# EAGLE design LAMPS (EAGLE 6.3)
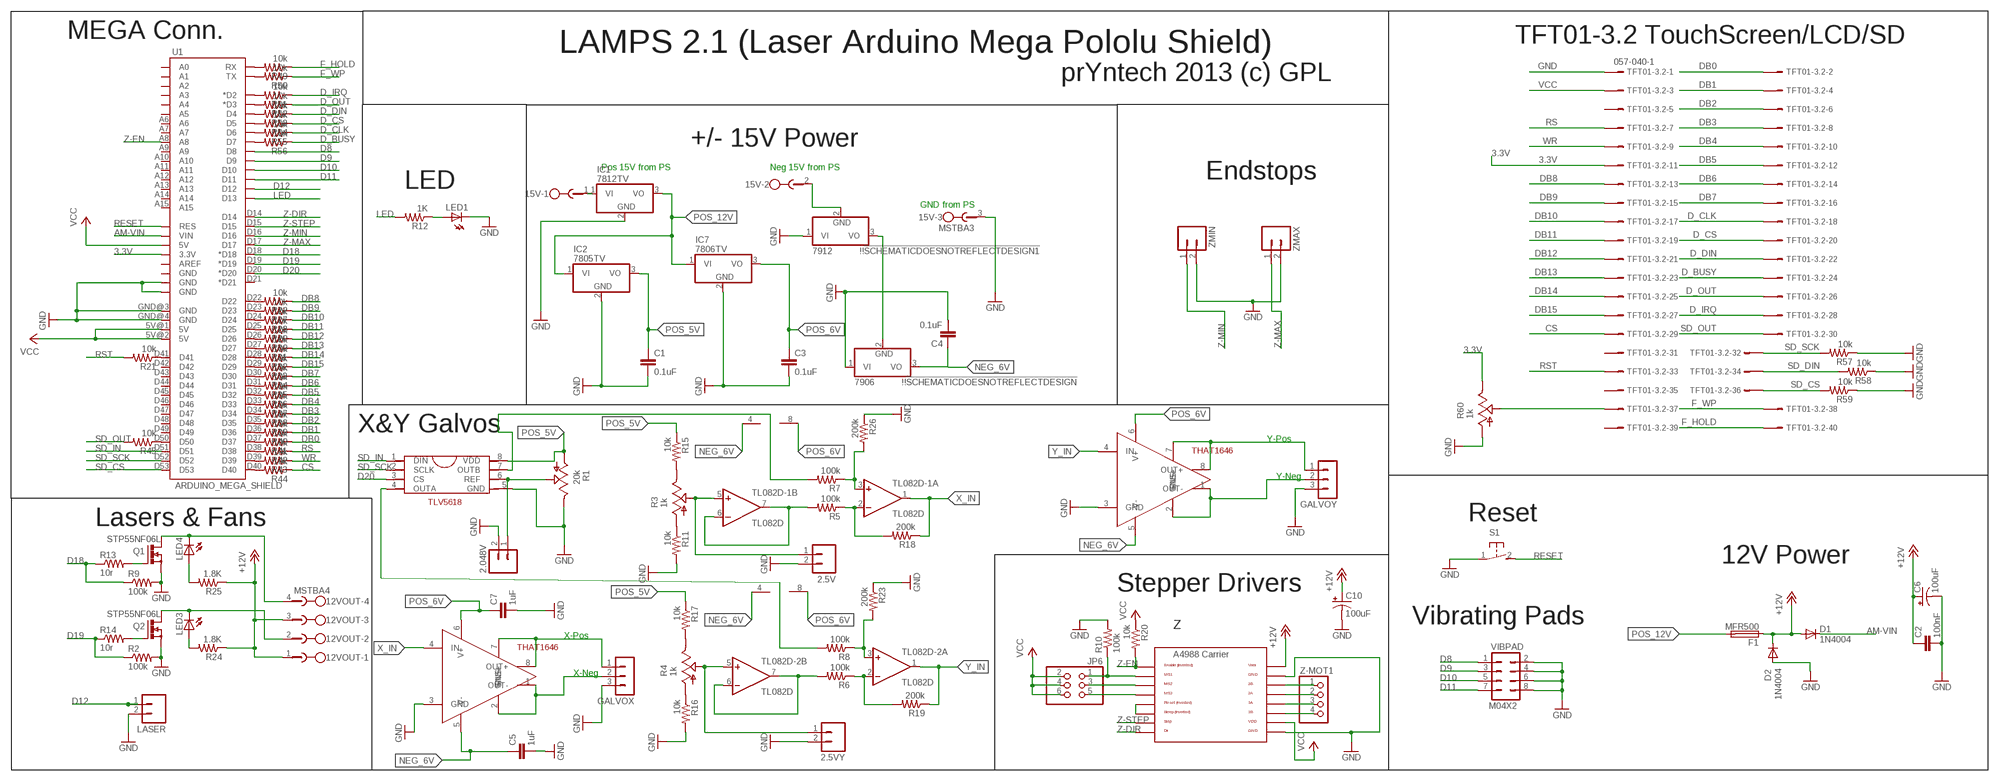
[diagram p0: schematic, sheet 1]

## Parts
2.5V  M02PTH  [1X02]
2.5VY  M02PTH  [1X02]
2.048V  M02PTH  [1X02]
12VOUT  MSTBA4  [MSTBA4]
15V  MSTBA3  [MSTBA3]
!!!SCHEMATICDOESNOTREFLECTDESIGN  7906  7805TV  [TO220V]
!!!SCHEMATICDOESNOTREFLECTDESIGN1  7912  7805TV  [TO220V]
C1  0.1uF  C2.5/2  [C2.5-2]
C2  100nF  C-EUC0805  [C0805]
C3  0.1uF  C2.5/2  [C2.5-2]
C4  0.1uF  C2.5/2  [C2.5-2]
C5  1uF  C2.5/2  [C2.5-2]
C6  100uF  CPOL-US153CLV-0605  [153CLV-0605]
C7  1uF  C2.5/2  [C2.5-2]
C10  100uF  CPOL-US153CLV-0605  [153CLV-0605]
D1  1N4004  [DO41-10]
D2  1N4004  [DO41-10]
F1  MFR500  PTCFUSE  [MFR500]
GALVOX  3PIN-HEADER  [3PIN-HEADER]
GALVOY  3PIN-HEADER  [3PIN-HEADER]
IC1  7812TV  [TO220V]
IC2  7805TV  [TO220V]
IC7  7806TV  7805TV  [TO220V]
JP6  PINHD-2X3  [2X03]
LASER  M02PTH  [1X02]
LED1  LEDCHIP-LED0805  [CHIP-LED0805]
LED3  LEDCHIP-LED0805  [CHIP-LED0805]
LED4  LEDCHIP-LED0805  [CHIP-LED0805]
Q1  STP55NF06L  IRF512  [TO220BV]
Q2  STP55NF06L  IRF512  [TO220BV]
R1  20k  TRIM_US-B25P  [B25P]
R2  100k  R-US_R0805  [R0805]
R3  1k  TRIM_US-B25P  [B25P]
R4  1k  TRIM_US-B25P  [B25P]
R5  100k  R-US_R0805  [R0805]
R6  100k  R-US_R0805  [R0805]
R7  100k  R-US_R0805  [R0805]
R8  100k  R-US_R0805  [R0805]
R9  100k  R-US_R0805  [R0805]
R10  100k  R-US_R0805  [R0805]
R11  10k  R-US_R0805  [R0805]
R12  1K  R-US_R0805  [R0805]
R13  10r  R-US_R0805  [R0805]
R14  10r  R-US_M0805  [M0805]
R15  10k  R-US_R0805  [R0805]
R16  10k  R-US_R0805  [R0805]
R17  10k  R-US_R0805  [R0805]
R18  200k  R-US_R0805  [R0805]
R19  200k  R-US_R0805  [R0805]
R20  10k  R-US_R0805  [R0805]
R21  10k  R-US_R0805  [R0805]
R22  10k  R-US_R0805  [R0805]
R23  200k  R-US_R0805  [R0805]
R24  1.8K  R-US_R0805  [R0805]
R25  1.8K  R-US_R0805  [R0805]
R26  200k  R-US_R0805  [R0805]
R27  10k  R-US_R0805  [R0805]
R28  10k  R-US_R0805  [R0805]
R29  10k  R-US_R0805  [R0805]
R30  10k  R-US_R0805  [R0805]
R31  10k  R-US_R0805  [R0805]
R32  10k  R-US_R0805  [R0805]
R33  10k  R-US_R0805  [R0805]
R34  10k  R-US_R0805  [R0805]
R35  10k  R-US_R0805  [R0805]
R36  10k  R-US_R0805  [R0805]
R37  10k  R-US_R0805  [R0805]
R38  10k  R-US_R0805  [R0805]
R39  10k  R-US_R0805  [R0805]
R40  10k  R-US_R0805  [R0805]
R41  10k  R-US_R0805  [R0805]
R42  10k  R-US_R0805  [R0805]
R43  10k  R-US_R0805  [R0805]
R44  10k  R-US_R0805  [R0805]
R45  10k  R-US_R0805  [R0805]
R49  10k  R-US_R0805  [R0805]
R50  10k  R-US_R0805  [R0805]
R51  10k  R-US_R0805  [R0805]
R52  10k  R-US_R0805  [R0805]
R53  10k  R-US_R0805  [R0805]
R54  10k  R-US_R0805  [R0805]
R55  10k  R-US_R0805  [R0805]
R56  10k  R-US_R0805  [R0805]
R57  10k  R-US_R0805  [R0805]
R58  10k  R-US_R0805  [R0805]
R59  10k  R-US_R0805  [R0805]
R60  1k  TRIM_US-B25P  [B25P]
S1  31-XX  [B3F-31XX]
TFT01-3.2  057-040-1  [057-040-1]
TL082D-1  TL082D  [SO08]
TL082D-2  TL082D  [SO08]
U1  ARDUINO_MEGA_SHIELD  [ARDUINO_MEGA_SHIELD]
U$1  THAT1646  [THAT1646]
U$2  THAT1646SMD  [TLV5618]
U$4  THAT1646  [THAT1646]
U$8  A4988BREAKOUT  [A4988BREAKOUT]
VIBPAD  M04X2  [2X4]
Z-MOT1  PINHD-1X4  [1X04]
ZMAX  M02PTH  [1X02]
ZMIN  M02PTH  [1X02]

## Nets
3.3V: R60.E TFT01-3.2.11 U1.3.3V
+12V [power]: 12VOUT.1 12VOUT.3 C2.1 C6.+ C10.+ D1.A D2.C F1.1 R24.1 R25.1 U$8.VMOT
AM-VIN [power]: D1.C U1.VIN
CS: R44.1 TFT01-3.2.29
D8: U1.D8 VIBPAD.1
D9: U1.D9 VIBPAD.3
D10: U1.D10 VIBPAD.5
D11: U1.D11 VIBPAD.7
D12: LASER.1 U1.D12
D18: R9.1 R13.1 U1.D18(*D18)
D19: R2.1 R14.1 U1.D19(*D19)
D20: U1.D20(*D20) U$2.3(CS)
D_BUSY: R56.1 TFT01-3.2.24
D_CLK: R55.1 TFT01-3.2.18
D_CS: R54.1 TFT01-3.2.20
D_DIN: R53.1 TFT01-3.2.22
D_IRQ: R51.1 TFT01-3.2.28
D_OUT: R52.1 TFT01-3.2.26
DB0: R41.1 TFT01-3.2.2
DB1: R40.1 TFT01-3.2.4
DB2: R39.1 TFT01-3.2.6
DB3: R38.1 TFT01-3.2.8
DB4: R37.1 TFT01-3.2.10
DB5: R36.1 TFT01-3.2.12
DB6: R35.1 TFT01-3.2.14
DB7: R34.1 TFT01-3.2.16
DB8: R22.1 TFT01-3.2.13
DB9: R27.1 TFT01-3.2.15
DB10: R28.1 TFT01-3.2.17
DB11: R29.1 TFT01-3.2.19
DB12: R30.1 TFT01-3.2.21
DB13: R31.1 TFT01-3.2.23
DB14: R32.1 TFT01-3.2.25
DB15: R33.1 TFT01-3.2.27
F_HOLD: R49.1 TFT01-3.2.40
F_WP: R50.1 TFT01-3.2.38
GND: 2.5V.2 2.5VY.2 2.048V.2 15V.3 !!!SCHEMATICDOESNOTREFLECTDESIGN1.1(VI) !!!SCHEMATICDOESNOTREFLECTDESIGN.1(VI) C1.2 C2.2 C3.2 C4.2 C5.2 C6.- C7.2 C10.- GALVOX.3 GALVOY.3 IC1.2(GND) IC2.2(GND) IC7.2(GND) LASER.2 LED1.C Q1.S Q2.S R1.E R2.2 R9.2 R10.2 R11.2 R16.2 R23.1 R26.1 R57.1 R58.1 R59.1 R60.A S1.1(P) TFT01-3.2.1 U1.GND@0(GND) U1.GND@1(GND) U1.GND@3(GND) U1.GND@4(GND) U$1.3(GND) U$2.5(GND) U$4.3(GND) U$8.GND U$8.GND@0(GND) VIBPAD.2 VIBPAD.4 VIBPAD.6 VIBPAD.8 ZMAX.2 ZMIN.2
GND_0: D2.A ; supply symbol labelled GND
LED: R12.2 U1.D13
N$1: 12VOUT.2 LED3.C Q2.D
N$2: R21.1 U1.D41
N$3: !!!SCHEMATICDOESNOTREFLECTDESIGN1.3(VO) !!!SCHEMATICDOESNOTREFLECTDESIGN.2(GND)
N$4: R4.A R16.1
N$5: R4.E R17.2
N$6: 2.048V.1 R1.S U$2.6(REF)
N$7: 12VOUT.4 LED4.C Q1.D
N$8: R3.A R11.1
N$9: R3.E R15.2
N$10: 2.5VY.1 R4.S TL082D-2.5(B:+IN)
N$11: 2.5V.1 R3.S TL082D-1.5(B:+IN)
N$12: GALVOX.2 U$1.1(OUT-) U$1.2(SNS-)
N$13: GALVOX.1 U$1.7(SNS+) U$1.8(OUT+)
N$14: R5.2 TL082D-1.6(B:-IN) TL082D-1.7(B:OUT)
N$15: R5.1 R18.2 TL082D-1.2(A:-IN)
N$16: R7.2 U$2.7(OUTB)
N$17: R7.1 R26.2 TL082D-1.3(A:+IN)
N$18: R6.2 TL082D-2.6(B:-IN) TL082D-2.7(B:OUT)
N$19: R22.2 U1.D22
N$20: R6.1 R19.2 TL082D-2.2(A:-IN)
N$21: R8.2 U$2.4(OUTA)
N$22: R8.1 R23.2 TL082D-2.3(A:+IN)
N$23: R27.2 U1.D23
N$24: GALVOY.2 U$4.1(OUT-) U$4.2(SNS-)
N$25: GALVOY.1 U$4.7(SNS+) U$4.8(OUT+)
N$26: R28.2 U1.D24
N$27: R29.2 U1.D25
N$28: R30.2 U1.D26
N$29: R31.2 U1.D27
N$30: R32.2 U1.D28
N$31: R33.2 U1.D29
N$32: R34.2 U1.D30
N$33: R35.2 U1.D31
N$34: R36.2 U1.D32
N$35: R37.2 U1.D33
N$36: R38.2 U1.D34
N$37: JP6.3 U$8.MS2
N$38: U$8.RST U$8.SLP(SLEEP)
N$39: JP6.5 U$8.MS3
N$40: JP6.1 R10.1 U$8.MS1
N$41: U$8.2B Z-MOT1.1
N$42: U$8.2A Z-MOT1.2
N$43: U$8.1A Z-MOT1.3
N$44: U$8.1B Z-MOT1.4
N$45: LED3.A R24.2
N$46: LED1.A R12.1
N$47: Q2.G R14.2
N$48: Q1.G R13.2
N$49: R39.2 U1.D35
N$50: LED4.A R25.2
N$51: R40.2 U1.D36
N$52: R41.2 U1.D37
N$53: R42.2 U1.D38
N$54: R43.2 U1.D39
N$55: R44.2 U1.D40
N$56: R45.1 U1.D50
N$58: 15V.1 IC1.1(VI)
N$59: 15V.2 !!!SCHEMATICDOESNOTREFLECTDESIGN1.2(GND)
N$60: R49.2 U1.RX
N$61: R50.2 U1.TX
N$62: R51.2 U1.D2(*D2)
N$63: R52.2 U1.D3(*D3)
N$64: R53.2 U1.D4
N$65: R54.2 U1.D5
N$66: R55.2 U1.D6
N$67: R56.2 U1.D7
N$86: R60.S TFT01-3.2.37
NEG_6V: !!!SCHEMATICDOESNOTREFLECTDESIGN.3(VO) C4.1 C5.1 TL082D-1.4(P:V-) TL082D-2.4(P:V-) U$1.5(V-)
POS_5V: C1.1 IC2.3(VO) R1.A R15.1 R17.1 U$2.8(VDD)
POS_6V: C3.1 C7.1 IC7.3(VO) TL082D-1.8(P:V+) TL082D-2.8(P:V+) U$1.6(V+) U$4.6(V+)
POS_12V [power]: F1.2 IC1.3(VO) IC2.1(VI) IC7.1(VI)
RESET: S1.2(S) U1.RES
RS: R42.1 TFT01-3.2.7
RST: R21.2 TFT01-3.2.33
SD_CS: R59.2 TFT01-3.2.36 U1.D53
SD_DIN: R58.2 TFT01-3.2.34
SD_IN: U1.D51 U$2.1(DIN)
SD_OUT: R45.2 TFT01-3.2.30
SD_SCK: R57.2 TFT01-3.2.32 U1.D52 U$2.2(SCLK)
T2_5: U$4.5(V-)
VCC: JP6.2 JP6.4 JP6.6 R20.1 TFT01-3.2.3 U1.5V@0(5V) U1.5V@1(5V) U1.5V@2(5V) U$8.VDD
WR: R43.1 TFT01-3.2.9
X_IN: R18.1 TL082D-1.1(A:OUT) U$1.4(IN)
Y_IN: R19.1 TL082D-2.1(A:OUT) U$4.4(IN)
Z-DIR: U1.D14 U$8.DIR
Z-EN: R20.2 U1.A8 U$8.EN
Z-MAX: U1.D17 ZMAX.1
Z-MIN: U1.D16 ZMIN.1
Z-STEP: U1.D15 U$8.STEP
Unconnected: TFT01-3.2.5 TFT01-3.2.31 TFT01-3.2.35 TFT01-3.2.39 U1.A0 U1.A1 U1.A2 U1.A3 U1.A4 U1.A5 U1.A6 U1.A7 U1.A9 U1.A10 U1.A11 U1.A12 U1.A13 U1.A14 U1.A15 U1.AREF U1.D21(*D21) U1.D42 U1.D43 U1.D44 U1.D45 U1.D46 U1.D47 U1.D48 U1.D49 U1.GND@2(GND)

## Notes on the sheet
- MEGA Conn. | TFT01-3.2 TouchScreen/LCD/SD
- LAMPS 2.1 (Laser Arduino Mega Pololu Shield)
- prYntech 2013 (c) GPL
- +/- 15V Power
- Pos 15V from PS | Neg 15V from PS
- Endstops
- LED
- GND from PS
- X&Y Galvos
- Y-Pos
- Y-Neg
- Lasers & Fans | Reset
- 12V Power
- Stepper Drivers
- Vibrating Pads
- Z
- X-Pos
- X-Neg

## Library data of the parts
2.5V 2.5VY 2.048V LASER ZMAX ZMIN = SparkFun:M02: Header 2 Standard 2-pin 0.1" header. Use with straight break away headers (SKU : PRT-00116), right angle break away headers (PRT-00553), swiss pins (PRT-00743), machine pins (PRT-00117), and female headers (PRT-00115). Molex polarized connector foot print use with SKU : PRT-08233 with associated crimp pins and housings.; OC_NEWARK: unknown
12VOUT = con-phoenix-508:MSTBA4: PHOENIX; OC_FARNELL: 3705195; OC_NEWARK: unknown
15V = con-phoenix-508:MSTBA3: PHOENIX; MF: FARNELL; MPN: 1757255; OC_FARNELL: 3705183; OC_NEWARK: 71C4162
!!!SCHEMATICDOESNOTREFLECTDESIGN !!!SCHEMATICDOESNOTREFLECTDESIGN1 = linear:78*: Positive VOLTAGE REGULATOR Source: http://cache.national.com/ds/LM/LM78L05.pdf http://www.fairchildsemi.com/ds/LM/LM7805.pdf; MPN: KA7906TU; OC_NEWARK: 94M7930
C1 C3-C5 C7 = capacitor-wima:C: CAPACITOR naming: grid - package width; OC_NEWARK: unknown
C2 = resistor:C-EU: CAPACITOR, European symbol; OC_NEWARK: unknown
C6 C10 = adafruit:CPOL-US: POLARIZED CAPACITOR, American symbol; OC_NEWARK: unknown
D1 D2 = diode:1N4004: DIODE general purpose rectifier, 1 A; OC_NEWARK: unknown
F1 = RepRapjr:PTCFUSE: LITTLEFUSE Picofuse/slow Littlefuse; OC_NEWARK: unknown
GALVOX GALVOY = ultimachine:3PIN-HEADER: PIN HEADER; OC_NEWARK: unknown
IC1 IC2 IC7 = linear:78*: Positive VOLTAGE REGULATOR Source: http://cache.national.com/ds/LM/LM78L05.pdf http://www.fairchildsemi.com/ds/LM/LM7805.pdf; OC_NEWARK: unknown
JP6 = pinhead:PINHD-2X3: PIN HEADER; OC_NEWARK: unknown
LED1 LED3 LED4 = led:LED: LED OSRAM: - CHIPLED LG R971, LG N971, LY N971, LG Q971, LY Q971, LO R971, LY R971 LH N974, LH R974 LS Q976, LO Q976, LY Q976 LO Q996 - Hyper CHIPLED LW Q18S LB Q993, LB Q99A, LB R99A - SideLED LS A670, LO A670, LY A670, LG A670, LP A670 LB A673, LV A673, LT A673, LW A673 LH A674 LY A675 LS A676, LA A676, LO A676, LY A676, LW A676 LS A679, LY A679, LG A679 - Hyper Micro SIDELED? LS Y876, LA Y876, LO Y876, LY Y876 LT Y87S - SmartLED LW L88C, LW L88S LB L89C, LB L89S, LG L890 LS L89K, LO L89K, LY L89K LS L896, LA L896, LO L896, LY L896 - TOPLED LS T670, LO T670, LY T670, LG T670, LP T670 LSG T670, LSP T670, LSY T670, LOP T670, LYG T670 LG T671, LOG T671, LSG T671 LB T673, LV T673, LT T673, LW T673 LH T674 LS T676, LA T676, LO T676, LY T676, LB T676, LH T676, LSB T676, LW T676 LB T67C, LV T67C, LT T67C, LS T67K, LO T67K, LY T67K, LW E67C LS E67B, LA E67B, LO E67B, LY E67B, LB E67C, LV E67C, LT E67C LW T67C LS T679, LY T679, LG T679 LS T770, LO T770, LY T770, LG T770, LP T770 LB T773, LV T773, LT T773, LW T773 LH T774 LS E675, LA E675, LY E675, LS T675 LS T776, LA T776, LO T776, LY T776, LB T776 LHGB T686 LT T68C, LB T68C - Hyper Mini TOPLED? LB M676 - Mini TOPLED Santana? LG M470 LS M47K, LO M47K, LY M47K Source: http://www.osram.convergy.de LUXEON: - LUMILED? LXK2-PW12-R00, LXK2-PW12-S00, LXK2-PW14-U00, LXK2-PW14-V00 LXK2-PM12-R00, LXK2-PM12-S00, LXK2-PM14-U00 LXK2-PE12-Q00, LXK2-PE12-R00, LXK2-PE12-S00, LXK2-PE14-T00, LXK2-PE14-U00 LXK2-PB12-K00, LXK2-PB12-L00, LXK2-PB12-M00, LXK2-PB14-N00, LXK2-PB14-P00, LXK2-PB14-Q00 LXK2-PR12-L00, LXK2-PR12-M00, LXK2-PR14-Q00, LXK2-PR14-R00 LXK2-PD12-Q00, LXK2-PD12-R00, LXK2-PD12-S00 LXK2-PH12-R00, LXK2-PH12-S00 LXK2-PL12-P00, LXK2-PL12-Q00, LXK2-PL12-R00 Source: www.luxeon.com KINGBRIGHT: KA-3528ASYC Source: www.kingbright.com; OC_NEWARK: unknown
Q1 Q2 = transistor-power:IRF512: N-CHANNEL MOS FET; MF: INTERNATIONAL RECTIFIER(IR); MPN: IRF1010EZPBF; OC_NEWARK: 63J7168
R1 R3 R4 R60 = pot:TRIM_US-: POTENTIOMETER; OC_NEWARK: unknown
R2 R5-R12 R15-R45 R49-R59 = adafruit:R-US_: RESISTOR, American symbol; OC_NEWARK: unknown
R13 R14 = resistor:R-US_: RESISTOR, American symbol; OC_NEWARK: unknown
S1 = switch-omron:31-XX: OMRON SWITCH; OC_FARNELL: 959704; OC_NEWARK: unknown
TFT01-3.2 = con-panduit:057-040-: CONNECTOR 40-pin series 057 contact pc board low profile headers; OC_FARNELL: unknown; OC_NEWARK: unknown
TL082D-1 TL082D-2 = linear:TL082: OP AMP; OC_NEWARK: unknown
U1 = RepRapjr:ARDUINO_MEGA_SHIELD; OC_NEWARK: unknown
U$1 U$4 = THAT1646:THAT1646: THAT 1646 Balanced Line Driver (DIP) Datasheet: http://www.thatcorp.com/datashts/THAT_1606-1646_Datasheet.pdf; MPN: THAT1646P08-U; OC_NEWARK: 50M5186
U$2 = TLV5618:THAT1646: TLV 5618 12 BIT DAC Datasheet: http://www.mouser.com/ds/2/405/slas230h-117520.pdf
U$8 = RepRapjr:A4988BREAKOUT; OC_NEWARK: unknown
VIBPAD = SparkFun:M04X2; OC_NEWARK: unknown
Z-MOT1 = RepRapjr:PINHD-1X4: PIN HEADER; OC_NEWARK: unknown

## Net classes
1 power: width 1.016 mm

## Board
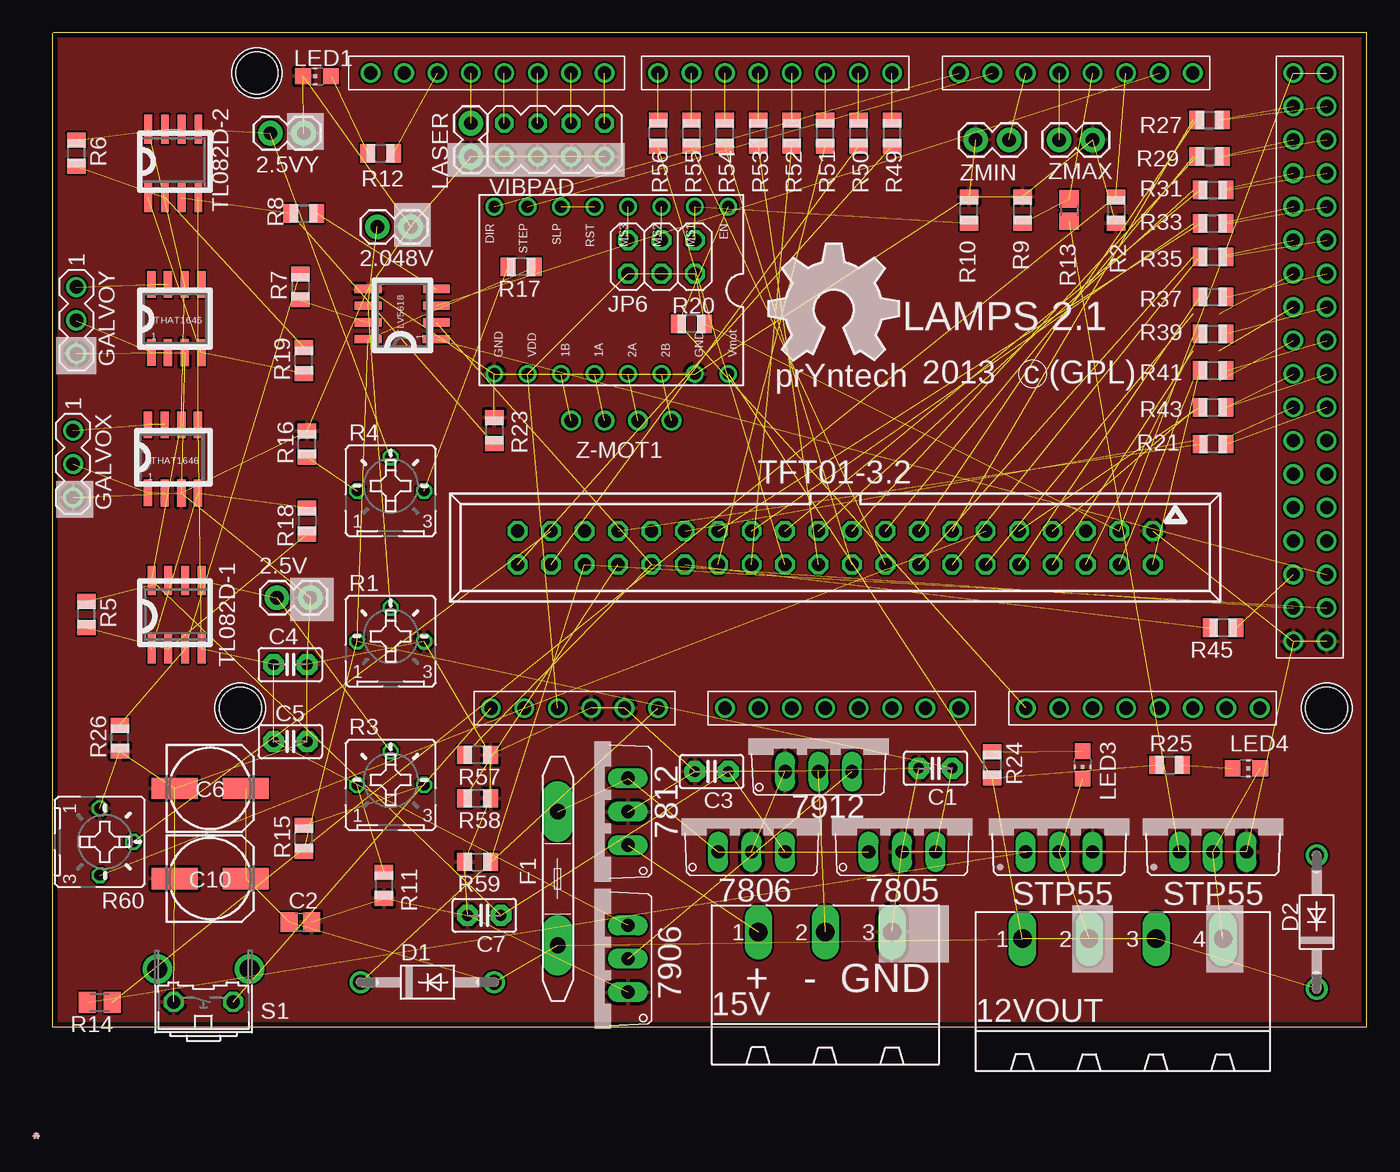
[diagram p1: board, top side]
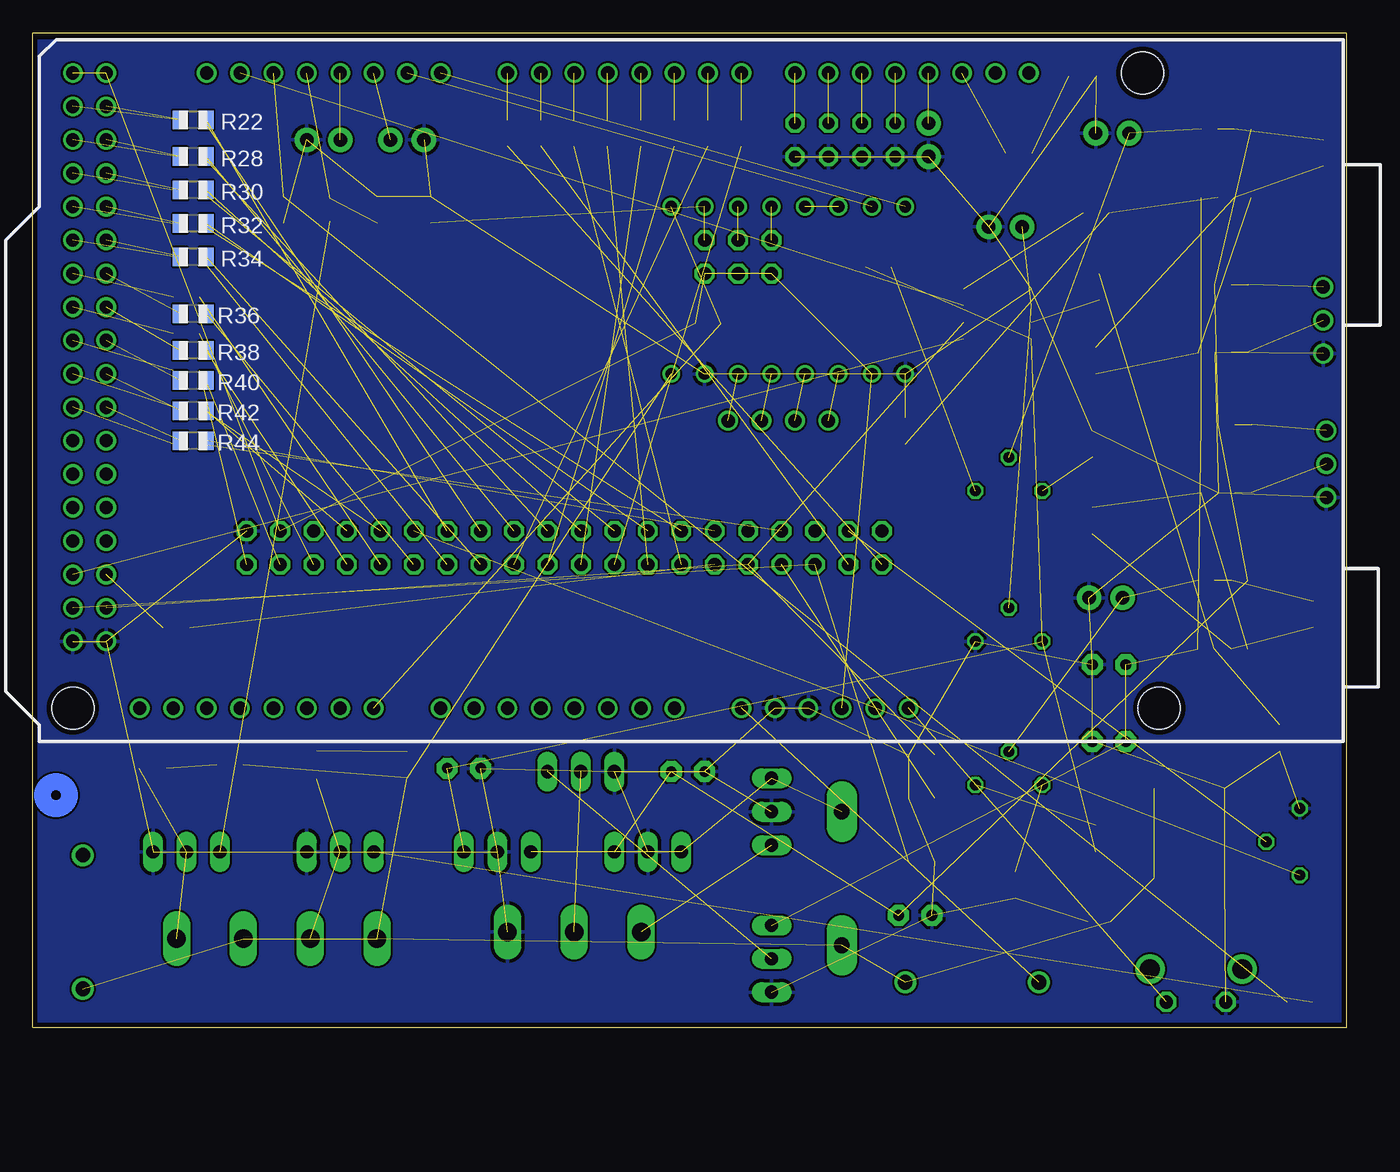
[diagram p2: board, bottom side, seen from below]

Size 99.82 x 75.56 mm. Coordinates in mm from the lower left corner, seen from the top.
Outline: 99.82,75.56 99.82,0 0,0 0,75.56
Outline: 99.82,75.56 0.01,75.56
Copper layers (1*16): Top 0.0356mm / dielectric 1.5011mm / Bottom 0.0356mm
Design rules "LaenPCBOrder": minimum track width 6mil, minimum drill 13mil, track to track 6mil, track to pad 6mil, pad to pad 6mil, via to via 6mil, smd to smd 6mil, copper to edge 15mil, drill to drill 6mil, minimum pad ring 7mil, minimum via ring 7mil, stop-mask expansion 4mil, vias tented up to drill 0mil, thermal gap 10mil

### Footprints (pad centres in the part's own frame; a part is rotated, then mirrored left to right if it is on the bottom)
1X02 = drill 1.016 pad 1.88: 1 0,0; 2 2.54,0
MSTBA4 = drill 1.397 long: 1 -7.62,5.08; 2 -2.54,5.08; 3 2.54,5.08; 4 7.62,5.08
MSTBA3 = drill 1.397 long: 1 -5.08,5.08; 2 0,5.08; 3 5.08,5.08
TO220V = drill 1.016 long: 1 -2.54,-2.54; 2 0,-2.54; 3 2.54,-2.54
C2.5-2 = drill 0.813 pad 1.6 octagon: 1 -1.27,0; 2 1.27,0
C0805 = smd 1.3 x 1.5: 1 -0.85,0; 2 0.85,0
153CLV-0605 = smd 3.5 x 1.6: + 2.7,0; - -2.7,0
DO41-10 = drill 1.118: A 5.08,0; C -5.08,0
MFR500 = drill 1.2 pad 2.3 long: 1 -5.08,0; 2 5.08,0
3PIN-HEADER = drill 1.016: 1 -2.54,0; 2 0,0; 3 2.54,0
2X03 = drill 1.016 octagon: 1 -2.54,-1.27; 2 -2.54,1.27; 3 0,-1.27; 4 0,1.27; 5 2.54,-1.27; 6 2.54,1.27
CHIP-LED0805 = smd 1.2 x 1.2: A 0,-1.05; C 0,1.05
TO220BV = drill 1.016 long: D 0,-2.54; G -2.54,-2.54; S 2.54,-2.54
B25P = drill 0.813 octagon: A -2.54,0; E 2.54,0; S 0,2.54
R0805 = smd 1.1 x 1.4: 1 -1,0; 2 1,0
R0805' = smd 1.3 x 1.5: 1 -0.85,0; 2 0.85,0
M0805 = smd 1.3 x 1.6: 1 -0.95,0; 2 0.95,0
B3F-31XX = drill 1.016 octagon: 1 -2.261,-1.245; 2 2.261,-1.245 | drill 1.499 pad 2.159: 3 -3.505,1.245; 4 3.505,1.245
057-040-1 = drill 1 octagon: 1 -24.13,-1.27; 2 -24.13,1.27; 3 -21.59,-1.27; 4 -21.59,1.27; 5 -19.05,-1.27; 6 -19.05,1.27; 7 -16.51,-1.27; 8 -16.51,1.27; 9 -13.97,-1.27; 10 -13.97,1.27; 11 -11.43,-1.27; 12 -11.43,1.27; 13 -8.89,-1.27; 14 -8.89,1.27; 15 -6.35,-1.27; 16 -6.35,1.27; 17 -3.81,-1.27; 18 -3.81,1.27; 19 -1.27,-1.27; 20 -1.27,1.27; 21 1.27,-1.27; 22 1.27,1.27; 23 3.81,-1.27; 24 3.81,1.27; 25 6.35,-1.27; 26 6.35,1.27; 27 8.89,-1.27; 28 8.89,1.27; 29 11.43,-1.27; 30 11.43,1.27; 31 13.97,-1.27; 32 13.97,1.27; 33 16.51,-1.27; 34 16.51,1.27; 35 19.05,-1.27; 36 19.05,1.27; 37 21.59,-1.27; 38 21.59,1.27; 39 24.13,-1.27; 40 24.13,1.27
SO08 = smd 0.6 x 2.2: 1 -1.905,-2.6; 2 -0.635,-2.6; 3 0.635,-2.6; 4 1.905,-2.6; 5 1.905,2.6; 6 0.635,2.6; 7 -0.635,2.6; 8 -1.905,2.6
ARDUINO_MEGA_SHIELD = drill 1 pad 1.422: 3.3V 35.56,2.54; 5V@0 38.1,2.54; 5V@1 93.98,50.8; 5V@2 96.52,50.8; A0 50.8,2.54; A1 53.34,2.54; A2 55.88,2.54; A3 58.42,2.54; A4 60.96,2.54; A5 63.5,2.54; A6 66.04,2.54; A7 68.58,2.54; A8 73.66,2.54; A9 76.2,2.54; A10 78.74,2.54; A11 81.28,2.54; A12 83.82,2.54; A13 86.36,2.54; A14 88.9,2.54; A15 91.44,2.54; AREF 23.876,50.8; D2 58.42,50.8; D3 55.88,50.8; D4 53.34,50.8; D5 50.8,50.8; D6 48.26,50.8; D7 45.72,50.8; D8 41.656,50.8; D9 39.116,50.8; D10 36.576,50.8; D11 34.036,50.8; D12 31.496,50.8; D13 28.956,50.8; D14 68.58,50.8; D15 71.12,50.8; D16 73.66,50.8; D17 76.2,50.8; D18 78.74,50.8; D19 81.28,50.8; D20 83.82,50.8; D21 86.36,50.8; D22 93.98,48.26; D23 96.52,48.26; D24 93.98,45.72; D25 96.52,45.72; D26 93.98,43.18; D27 96.52,43.18; D28 93.98,40.64; D29 96.52,40.64; D30 93.98,38.1; D31 96.52,38.1; D32 93.98,35.56; D33 96.52,35.56; D34 93.98,33.02; D35 96.52,33.02; D36 93.98,30.48; D37 96.52,30.48; D38 93.98,27.94; D39 96.52,27.94; D40 93.98,25.4; D41 96.52,25.4; D42 93.98,22.86; D43 96.52,22.86; D44 93.98,20.32; D45 96.52,20.32; D46 93.98,17.78; D47 96.52,17.78; D48 93.98,15.24; D49 96.52,15.24; D50 93.98,12.7; D51 96.52,12.7; D52 93.98,10.16; D53 96.52,10.16; GND@0 40.64,2.54; GND@1 43.18,2.54; GND@2 26.416,50.8; GND@3 93.98,7.62; GND@4 96.52,7.62; RES 33.02,2.54; RX 63.5,50.8; TX 60.96,50.8; VIN 45.72,2.54 | hole 3.2: 96.52,2.54; 13.97,2.54; 15.24,50.8
THAT1646 = smd 0.635 x 2.032: 1 0.61,-0.652; 2 1.88,-0.676; 3 3.15,-0.676; 4 4.42,-0.676; 5 4.42,4.511; 6 3.15,4.511; 7 1.88,4.511; 8 0.61,4.511
TLV5618 = smd 0.635 x 2.032: 1 0.61,-0.652; 2 1.88,-0.676; 3 3.15,-0.676; 4 4.42,-0.676; 5 4.42,4.511; 6 3.15,4.511; 7 1.88,4.511; 8 0.61,4.511
A4988BREAKOUT = drill 0.9: 1A 8.89,1.27; 1B 11.43,1.27; 2A 6.35,1.27; 2B 3.81,1.27; DIR 16.51,-11.43; EN -1.27,-11.43; GND 16.51,1.27; GND@0 1.27,1.27; MS1 1.27,-11.43; MS2 3.81,-11.43; MS3 6.35,-11.43; RST 8.89,-11.43; SLP 11.43,-11.43; STEP 13.97,-11.43; VDD 13.97,1.27; VMOT -1.27,1.27
2X4 = drill 0.9 pad 1.422 octagon: 1 -3.81,-1.27; 2 -3.81,1.27; 3 -1.27,-1.27; 4 -1.27,1.27; 5 1.27,-1.27; 6 1.27,1.27; 7 3.81,-1.27; 8 3.81,1.27
1X04 = drill 1.016: 1 -2.54,0; 2 0,0; 3 2.54,0; 4 5.08,0

### Placement (x,y rotation side)
2.5V  17.03,32.64 0 top
2.5VY  16.52,67.95 0 top
2.048V  24.65,60.83 0 top
12VOUT  81.29,1.65 0 top
15V  58.69,2.16 0 top
!!!SCHEMATICDOESNOTREFLECTDESIGN  41.16,5.21 90 top
!!!SCHEMATICDOESNOTREFLECTDESIGN1  58.18,21.97 0 top
C1  67.07,19.69 180 top
C2  18.81,8 0 top
C3  50.05,19.43 180 top
C4  18.05,27.56 0 top
C5  18.05,21.72 0 top
C6  11.95,18.16 0 top
C7  32.78,8.51 180 top
C10  11.95,11.3 0 top
D1  28.46,3.43 0 top
D2  96.02,8 90 top
F1  38.37,11.3 90 top
GALVOX  1.54,42.8 270 top
GALVOY  1.79,53.72 270 top
IC1  41.16,16.38 90 top
IC2  64.53,15.87 0 top
IC7  53.1,15.87 0 top
JP6  46.24,58.55 180 top
LASER  31.76,68.71 270 top
LED1  20.08,72.26 90 top
LED3  78.24,19.94 180 top
LED4  90.69,19.69 270 top
Q1  88.15,15.87 0 top
Q2  76.47,15.87 0 top
R1  25.67,29.34 0 top
R2  80.78,62.1 270 top
R3  25.67,18.41 0 top
R4  25.67,40.77 0 top
R5  2.55,31.37 90 top
R6  1.79,66.42 90 top
R7  18.81,56.26 270 top
R8  19.06,61.85 0 top
R9  73.67,62.1 90 top
R10  69.61,62.1 90 top
R11  25.16,10.79 270 top
R12  24.9,66.42 0 top
R13  10r  [R0805']  77.23,62.1 270 top
R14  3.57,1.9 180 top
R15  19.06,14.35 90 top
R16  19.32,44.32 90 top
R17  35.57,57.79 180 top
R18  19.32,38.48 270 top
R19  19.06,50.67 90 top
R20  48.53,53.47 180 top
R21  88.15,44.32 180 top
R22  87.64,68.96 180 bottom
R23  33.54,45.34 270 top
R24  71.39,19.94 90 top
R25  84.85,19.94 0 top
R26  5.09,21.97 90 top
R27  87.9,68.96 0 top
R28  87.64,66.17 180 bottom
R29  87.9,66.17 0 top
R30  87.64,63.63 180 bottom
R31  88.15,63.63 0 top
R32  87.64,61.09 180 bottom
R33  88.15,61.09 0 top
R34  87.64,58.55 180 bottom
R35  88.15,58.55 0 top
R36  87.64,54.23 180 bottom
R37  88.15,55.5 0 top
R38  87.64,51.43 180 bottom
R39  88.15,52.7 0 top
R40  87.64,49.15 180 bottom
R41  88.15,49.91 0 top
R42  87.64,46.86 180 bottom
R43  88.15,47.12 0 top
R44  87.64,44.58 180 bottom
R45  88.91,30.35 180 top
R49  63.77,67.95 90 top
R50  61.23,67.95 90 top
R51  58.69,67.95 90 top
R52  56.15,67.95 90 top
R53  53.61,67.95 90 top
R54  51.07,67.95 90 top
R55  48.53,67.95 90 top
R56  45.99,67.95 90 top
R57  32.27,20.7 180 top
R58  32.27,17.4 180 top
R59  32.27,12.57 0 top
R60  3.57,14.1 270 top
S1  11.44,3.17 0 top
TFT01-3.2  59.45,36.45 180 top
TL082D-1  9.41,31.37 0 top
TL082D-2  9.16,65.66 0 top
U1  0.27,21.72 0 top
U$1  6.62,41.27 0 top
U$2  28.46,51.69 90 top
U$3  [OSHW_FILLX350_NOTEXT]  54.37,50.67 0 top
U$4  6.87,51.94 0 top
U$8  50.05,50.93 180 top
VIBPAD  38.11,67.44 180 top
Z-MOT1  44.46,46.1 180 top
ZMAX  76.47,67.44 0 top
ZMIN  72.66,67.44 180 top

### Tracks (layer width: path | path; a pad name or v marks a point on that pad's centre or on a via)
3.3V  (2 unrouted)
+12V  (10 unrouted)
AM-VIN  (1 unrouted)
CS  (1 unrouted)
D8  (1 unrouted)
D9  (1 unrouted)
D10  (1 unrouted)
D11  (1 unrouted)
D12  (1 unrouted)
D18  (2 unrouted)
D19  (2 unrouted)
D20  (1 unrouted)
D_BUSY  (1 unrouted)
D_CLK  (1 unrouted)
D_CS  (1 unrouted)
D_DIN  (1 unrouted)
D_IRQ  (1 unrouted)
D_OUT  (1 unrouted)
DB0  (1 unrouted)
DB1  (1 unrouted)
DB2  (1 unrouted)
DB3  (1 unrouted)
DB4  (1 unrouted)
DB5  (1 unrouted)
DB6  (1 unrouted)
DB7  (1 unrouted)
DB8  (1 unrouted)
DB9  (1 unrouted)
DB10  (1 unrouted)
DB11  (1 unrouted)
DB12  (1 unrouted)
DB13  (1 unrouted)
DB14  (1 unrouted)
DB15  (1 unrouted)
F_HOLD  (1 unrouted)
F_WP  (1 unrouted)
GND  (51 unrouted)
  pour Top: 0.01,-0.13 99.83,-0.13 99.58,-0.13 99.58,75.31 0.01,75.31 0.01,74.8
  pour Bottom: 0.01,-0.38 99.83,-0.38 99.58,-0.38 99.58,75.06 0.01,75.06 0.01,74.55
LED  (1 unrouted)
N$1  (2 unrouted)
N$2  (1 unrouted)
N$3  (1 unrouted)
N$4  (1 unrouted)
N$5  (1 unrouted)
N$6  (2 unrouted)
N$7  (2 unrouted)
N$8  (1 unrouted)
N$9  (1 unrouted)
N$10  (2 unrouted)
N$11  (2 unrouted)
N$12  (2 unrouted)
N$13  (2 unrouted)
N$14  (2 unrouted)
N$15  (2 unrouted)
N$16  (1 unrouted)
N$17  (2 unrouted)
N$18  (2 unrouted)
N$19  (1 unrouted)
N$20  (2 unrouted)
N$21  (1 unrouted)
N$22  (2 unrouted)
N$23  (1 unrouted)
N$24  (2 unrouted)
N$25  (2 unrouted)
N$26  (1 unrouted)
N$27  (1 unrouted)
N$28  (1 unrouted)
N$29  (1 unrouted)
N$30  (1 unrouted)
N$31  (1 unrouted)
N$32  (1 unrouted)
N$33  (1 unrouted)
N$34  (1 unrouted)
N$35  (1 unrouted)
N$36  (1 unrouted)
N$37  (1 unrouted)
N$38  (1 unrouted)
N$39  (1 unrouted)
N$40  (2 unrouted)
N$41  (1 unrouted)
N$42  (1 unrouted)
N$43  (1 unrouted)
N$44  (1 unrouted)
N$45  (1 unrouted)
N$46  (1 unrouted)
N$47  (1 unrouted)
N$48  (1 unrouted)
N$49  (1 unrouted)
N$50  (1 unrouted)
N$51  (1 unrouted)
N$52  (1 unrouted)
N$53  (1 unrouted)
N$54  (1 unrouted)
N$55  (1 unrouted)
N$56  (1 unrouted)
N$58  (1 unrouted)
N$59  (1 unrouted)
N$60  (1 unrouted)
N$61  (1 unrouted)
N$62  (1 unrouted)
N$63  (1 unrouted)
N$64  (1 unrouted)
N$65  (1 unrouted)
N$66  (1 unrouted)
N$67  (1 unrouted)
N$68
  Top 0: -1.26,-8.26 arc10 -1.26,-8.26 | -1.26,-8.26 -1.25,-8.26 -1.26,-8.26 arc19 -1.26,-8.26 | -1.26,-8.26 -1.25,-8.26 | -1.25,-8.26 | -1.25,-8.26 -1.26,-8.26 | -1.26,-8.26 arc19 -1.26,-8.25 -1.25,-8.25 -1.26,-8.25 -1.26,-8.25 arc19 -1.26,-8.25 | -1.26,-8.25 | -1.26,-8.25 | -1.26,-8.25 | -1.26,-8.25 arc19 -1.26,-8.25 -1.26,-8.25 arc19 -1.26,-8.26 | -1.26,-8.26 | -1.26,-8.26 | -1.26,-8.26 | -1.26,-8.26 arc19 -1.26,-8.26 | -1.26,-8.26 arc10 -1.26,-8.26 | -1.26,-8.26 | -1.26,-8.26 arc-67 -1.26,-8.26 arc-248 -1.26,-8.26 | -1.26,-8.26
N$69
  Top 0.001: -1.19,-8.42 arc9 -1.16,-8.41 -1.1,-8.46 -1.05,-8.41 -1.11,-8.35 arc19 -1.09,-8.29 -1,-8.29 -1,-8.22 -1.09,-8.22 arc19 -1.11,-8.16 -1.05,-8.1 -1.1,-8.05 -1.16,-8.11 arc19 -1.22,-8.08 -1.23,-8 -1.29,-8 -1.3,-8.08 arc19 -1.35,-8.11 -1.42,-8.05 -1.46,-8.1 -1.41,-8.16 arc19 -1.43,-8.22 -1.51,-8.22 -1.51,-8.29 -1.43,-8.29 arc19 -1.41,-8.35 -1.46,-8.41 -1.42,-8.46 -1.35,-8.41 arc9 -1.33,-8.42 -1.29,-8.33 arc-67 -1.34,-8.26 arc-247 -1.23,-8.33 -1.19,-8.42
N$86  (1 unrouted)
NEG_6V  (5 unrouted)
POS_5V  (5 unrouted)
POS_6V  (6 unrouted)
POS_12V  (3 unrouted)
RESET  (1 unrouted)
RS  (1 unrouted)
RST  (1 unrouted)
SD_CS  (2 unrouted)
SD_DIN  (1 unrouted)
SD_IN  (1 unrouted)
SD_OUT  (1 unrouted)
SD_SCK  (3 unrouted)
VCC  (8 unrouted)
WR  (1 unrouted)
X_IN  (2 unrouted)
Y_IN  (2 unrouted)
Z-DIR  (1 unrouted)
Z-EN  (2 unrouted)
Z-MAX  (1 unrouted)
Z-MIN  (1 unrouted)
Z-STEP  (1 unrouted)
(copper drawn outside any net)
  shapes: Bottom circle x1

### Text on the board
tNames: LAMPS 2.1 | prYntech | 2013 c (GPL) | 7912 | 7812 | 7806 | 7805 | STP55 | STP55 | + - GND | 7906
Document: LAMPS 2.1 (Laser Arduino MEGA Pololu Shield)